# EAGLE design Heaterboard (EAGLE 9.3.1)
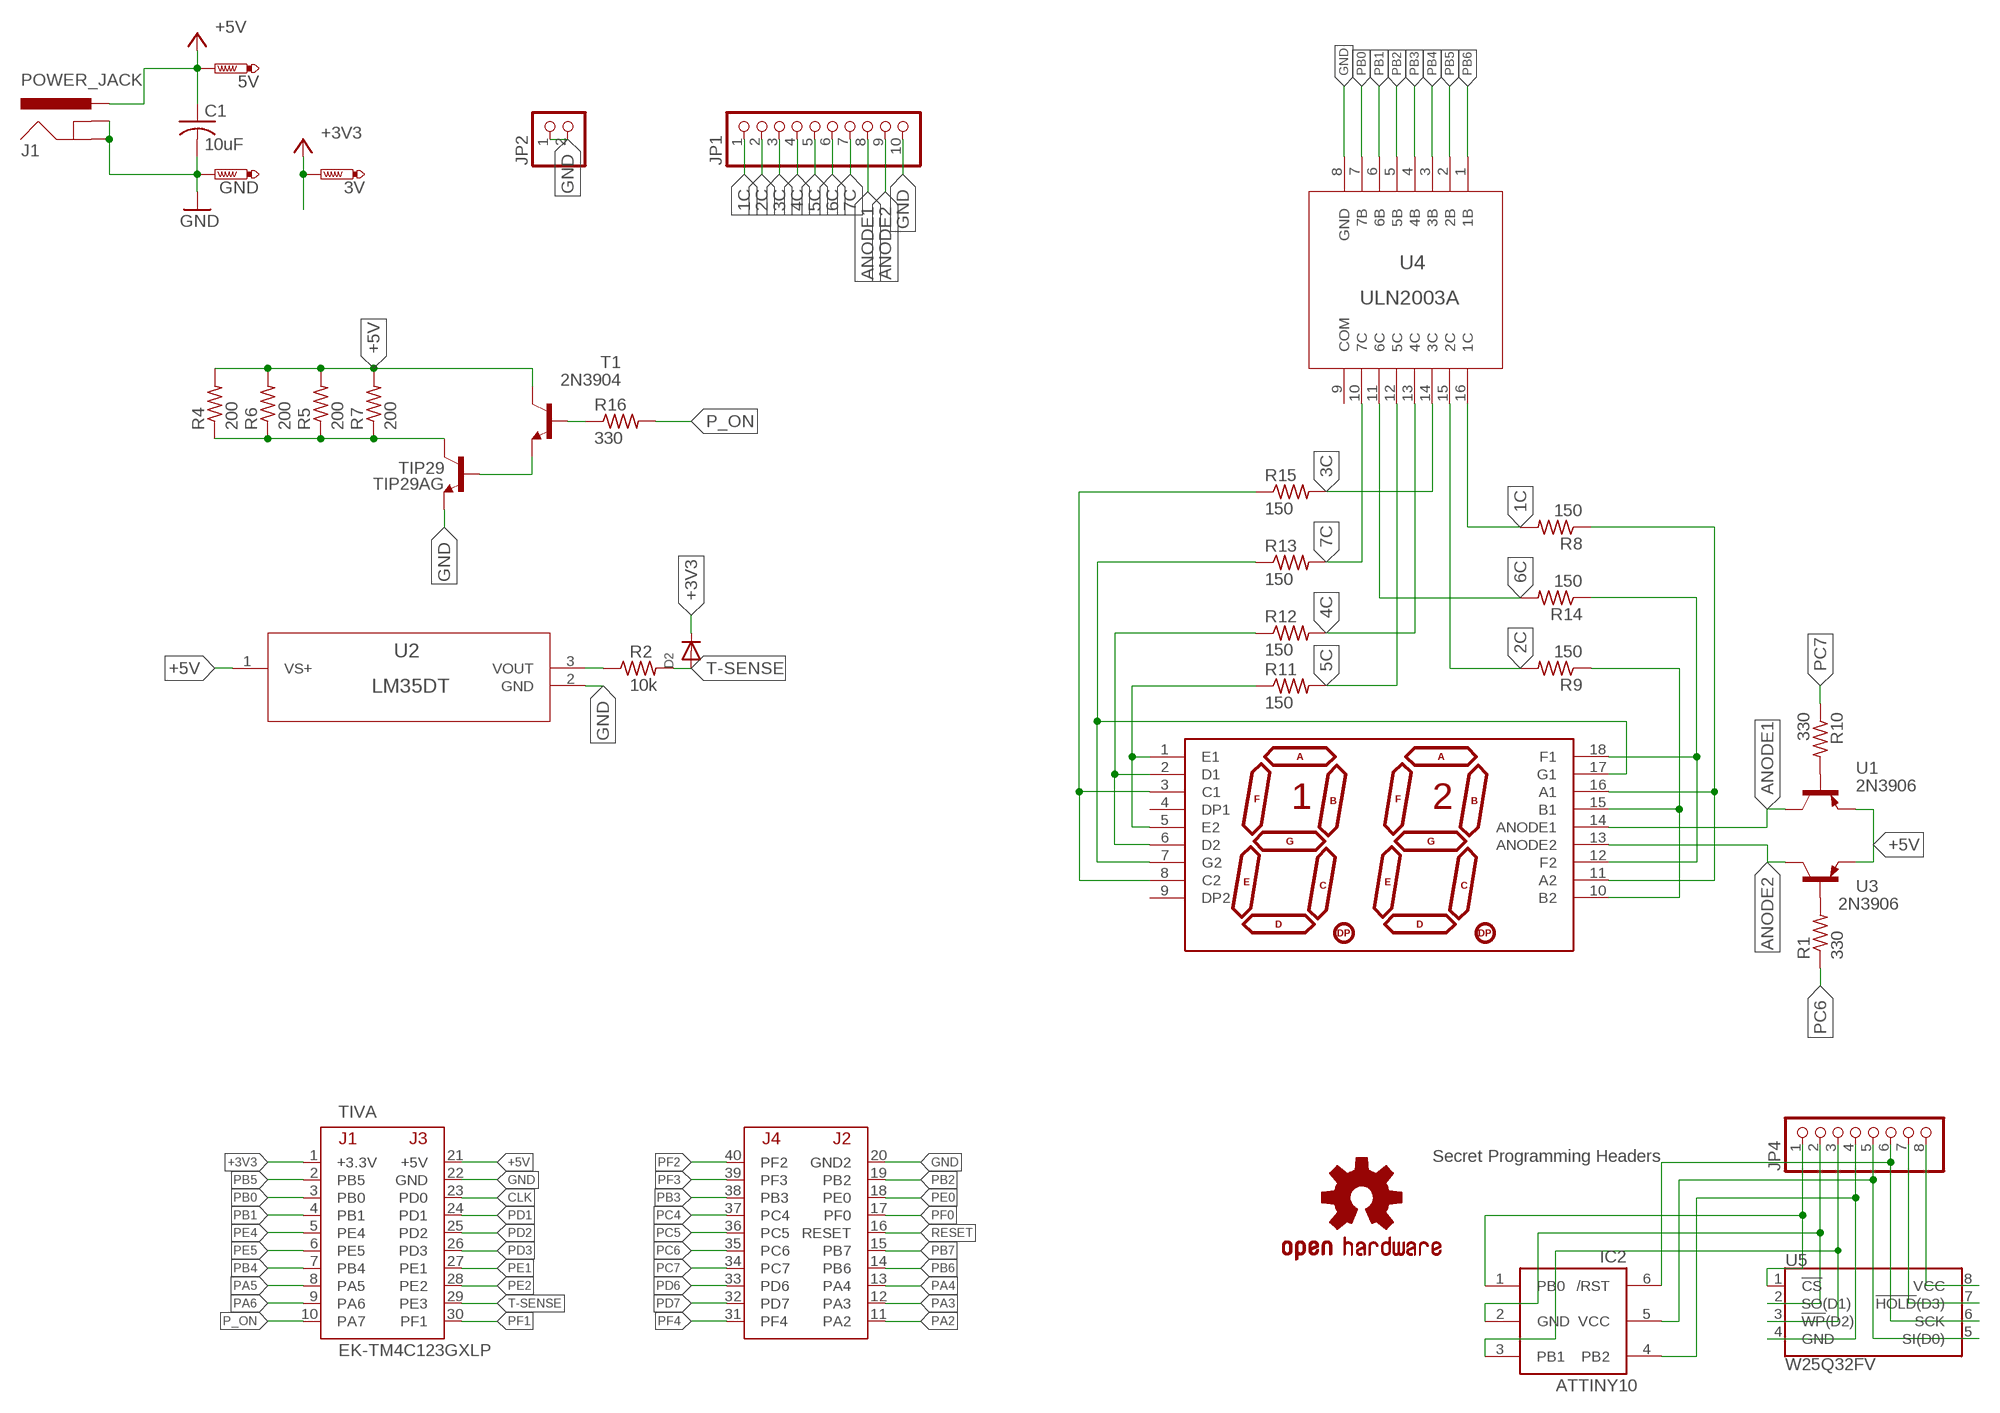
[diagram p0: schematic, sheet 1]

## Parts
3V  PTR1PAD1-13  [P1-13]
5V  PTR1PAD1-13  [P1-13]
7SEG  NTE3074  [NTE3074]
C1  10uF  C-US025-030X050  [C025-030X050]
D2  DIODEDO-1N4148  [DO-1N4148]
GND  PTR1PAD1-13  [P1-13]
IC2  ATTINY10  [SOT23-6]
J1  POWER_JACK  [POWER_JACK_PTH]
JP1  PINHD-1X10/90  [1X10/90]
JP2  PINHD-1X2  [1X02]
JP4  PINHD-1X8  [1X08]
LOGO1  OSHW-LOGOL  [OSHW-LOGO-L]
R1  330  R-US_0204/5  [0204/5]
R2  10k  R-US_0204/5  [0204/5]
R4  200  R-US_0207/10  [0207/10]
R5  200  R-US_0207/10  [0207/10]
R6  200  R-US_0207/10  [0207/10]
R7  200  R-US_0207/10  [0207/10]
R8  150  R-US_0204/5  [0204/5]
R9  150  R-US_0204/5  [0204/5]
R10  330  R-US_0204/5  [0204/5]
R11  150  R-US_0204/5  [0204/5]
R12  150  R-US_0204/5  [0204/5]
R13  150  R-US_0204/5  [0204/5]
R14  150  R-US_0204/5  [0204/5]
R15  150  R-US_0204/5  [0204/5]
R16  330  R-US_0204/5  [0204/5]
T1  2N3904  [TO92]
TIP29  TIP29AG  [TO220]
TIVA  EK-TM4C123GXLP  [TM4C123LAUNCHPAD]
U1  2N3906  [TO-92_2]
U2  LM35DT  [TA03F]
U3  2N3906  [TO-92_2]
U4  ULN2003A  [DIP-16]
U5  W25Q32FV  W25Q32FVSS  [SOIC-8]

## Nets
1C: JP1.1 R8.2 U4.16(1C)
2C: JP1.2 R9.2 U4.15(2C)
3C: JP1.3 R15.2 U4.14(3C)
4C: JP1.4 R12.2 U4.13(4C)
5C: JP1.5 R11.2 U4.12(5C)
6C: JP1.6 R14.2 U4.11(6C)
7C: JP1.7 R13.2 U4.10(7C)
+3V3 [Power]: 3V.TP D2.C TIVA.1(+3.3V)
+5V [High Current]: 5V.TP C1.1 J1.PWR R4.2 R5.2 R6.2 R7.2 T1.1(C) TIVA.21(+5V) U1.3(E) U2.1(VS+) U3.3(E)
ANODE1: 7SEG.14(ANODE1) JP1.8 U1.1(C)
ANODE2: 7SEG.13(ANODE2) JP1.9 U3.1(C)
CLK: TIVA.23(PD0)
GND [Power]: C1.2 GND.TP J1.GND J1.GNDBREAK JP1.10 JP2.1 JP2.2 TIP29.3(E) TIVA.20(GND2) TIVA.22(GND) U2.2(GND) U4.8(GND)
HEATER_COM [High Current]: R4.1 R5.1 R6.1 R7.1 TIP29.2(C)
N$1: R2.1 U2.3(VOUT)
N$3: R16.1 T1.2(B)
N$4: T1.3(E) TIP29.1(B)
N$5: R10.2 U1.2(B)
N$8: R1.2 U3.2(B)
N$9: 7SEG.11(A2) 7SEG.16(A1) R8.1
N$10: IC2.4(PB2) JP4.4 U5.4(GND)
N$12: 7SEG.10(B2) 7SEG.15(B1) R9.1
N$13: 7SEG.3(C1) 7SEG.8(C2) R15.1
N$14: 7SEG.2(D1) 7SEG.6(D2) R12.1
N$15: 7SEG.1(E1) 7SEG.5(E2) R11.1
N$16: 7SEG.12(F2) 7SEG.18(F1) R14.1
N$17: 7SEG.7(G2) 7SEG.17(G1) R13.1
N$19: IC2.1(PB0) JP4.1 U5.1(!CS!)
N$20: IC2.2(GND) JP4.2 U5.2(SO(D1))
N$21: IC2.3(PB1) JP4.3 U5.3(!WP!(D2))
N$23: IC2.5(VCC) JP4.5 U5.5(SI(D0))
N$24: IC2.6(/RST) JP4.6 U5.6(SCK)
N$25: JP4.7 U5.7(!HOLD!(D3))
N$26: JP4.8 U5.8(VCC)
P_ON: R16.2 TIVA.10(PA7)
PA2: TIVA.11(PA2)
PA3: TIVA.12(PA3)
PA4: TIVA.13(PA4)
PA5: TIVA.8(PA5)
PA6: TIVA.9(PA6)
PB0: TIVA.3(PB0) U4.7(7B)
PB1: TIVA.4(PB1) U4.6(6B)
PB2: TIVA.19(PB2) U4.5(5B)
PB3: TIVA.38(PB3) U4.4(4B)
PB4: TIVA.7(PB4) U4.3(3B)
PB5: TIVA.2(PB5) U4.2(2B)
PB6: TIVA.14(PB6) U4.1(1B)
PB7: TIVA.15(PB7)
PC4: TIVA.37(PC4)
PC5: TIVA.36(PC5)
PC6: R1.1 TIVA.35(PC6)
PC7: R10.1 TIVA.34(PC7)
PD1: TIVA.24(PD1)
PD2: TIVA.25(PD2)
PD3: TIVA.26(PD3)
PD6: TIVA.33(PD6)
PD7: TIVA.32(PD7)
PE0: TIVA.18(PE0)
PE1: TIVA.27(PE1)
PE2: TIVA.28(PE2)
PE4: TIVA.5(PE4)
PE5: TIVA.6(PE5)
PF0: TIVA.17(PF0)
PF1: TIVA.30(PF1)
PF2: TIVA.40(PF2)
PF3: TIVA.39(PF3)
PF4: TIVA.31(PF4)
RESET: TIVA.16(RESET)
T-SENSE: D2.A R2.2 TIVA.29(PE3)
Unconnected: 7SEG.4(DP1) 7SEG.9(DP2) U4.9(COM)

## Notes on the sheet
- Secret Programming Headers

## Library data of the parts
3V 5V GND = testpad:PTR1: TEST PIN
7SEG = partlibrary:NTE3074
C1 = resistor:C-US: CAPACITOR, American symbol
D2 = adafruit:DIODE: Diode SMADIODE - SMA Surface Mount Package 20V 1A Schottky Diode Digikey: 641-1014-6-ND DO-1N4148 - Through Hole Small Current Diode SOD-123 20V 1 A (.5mV Vf) Schottky Diode - Digikey: MBRX120TPMSCT-ND SOD-323 10V 570mA (.38mV Vf, 3ns) Schottky Diode - Digikey: ZLLS410CT-ND SOD-523 30V 30mA Schottky Diode (RB751S-40TE61) - Digikey: RB751S-40TE61CT-ND SOT23-R/W - SOT23 Package (R = Solder Paste/Reflow Ovens, W = Hand-Soldering) BAT54Film 40V 300mA - Digikey: 497-7162-1-ND
IC2 = adafruit:ATTINY10: ATtiny4/5/9/10 8-bit Microcontroller with 512/1024 Bytes In-System Programmable Flash
J1 = SparkFun-Connectors:POWER_JACK: Power Jack Connector This is the standard 5.5mm barrel jack for power. The PTH is the most common, proven, reliable, footprint. The Slot footprint only works if the mill layer is transmitted to the PCB fab house so be warned. Here are the connectors we sell at SparkFun: DC Barrel Power Jack/Connector <https://www.sparkfun.com/products/119> (PRT-00119) DC Barrel Power Jack/Connector (SMD) <https://www.sparkfun.com/products/12748> (PRT-12748) DC Barrel Jack Adapter - Breadboard Compatible <https://www.sparkfun.com/products/10811> (PRT-10811) It is used on this SparkFun product (and many, many others): SparkFun RedBoard - Programmed with Arduino <https://www.sparkfun.com/products/12757> (DEV-12757) Also, if you need a mating power supply or connector, please check these out: Wall Adapter Power Supply - 9VDC 650mA <https://www.sparkfun.com/products/298> (TOL-00298) DC Barrel Jack Adapter - Male <https://www.sparkfun.com/products/10287> (PRT-10287); PROD_ID: CONN-08197
JP1 = pinhead:PINHD-1X10: PIN HEADER
JP2 = pinhead:PINHD-1X2: PIN HEADER
JP4 = pinhead:PINHD-1X8: PIN HEADER
LOGO1 = SparkFun-Aesthetics:OSHW-LOGO: Open-Source Hardware (OSHW) Logo This logo indicates the piece of hardware it is found on incorporates a OSHW license and/or adheres to the definition of open source hardware found here: http://freedomdefined.org/OSHW
R1 R2 R4-R16 = resistor:R-US_: RESISTOR, American symbol
T1 = transistor:2N3904: NPN TRANSISTOR
TIP29 = partlibrary:TIP29AG
TIVA = EK-TM4C123GXL:EK-TM4C123GXL: Texas Instruments TM4C123 LaunchPad EK-TM4C123GXL www.ti.com/tool/ek-tm4c123gxl; AVAILABILITY: Unavailable; DESCRIPTION: Evaluation Kit For ARM Cortex-M4F-based Microcontrollers; MF: Texas Instruments; MP: EK-TM4C123GXL; PACKAGE: None; PRICE: None
U1 U3 = partlibrary:2N3906; MANUFACTURER_PART_NUMBER: 2N3906; VENDOR: Fairchild Semiconductor
U2 = partlibrary:LM35DT; MANUFACTURER_PART_NUMBER: LM35DT; VENDOR: Texas Instruments
U4 = partlibrary:ULN2003A; MANUFACTURER_PART_NUMBER: ULN2003A; VENDOR: STMicroelectronics
U5 = SparkFun-IC-Memory:W25Q32FV: W25Q32FV 32Mb (4MB) Serial Flash Memory The W25Q32FV support the standard Serial Peripheral Interface (SPI), Dual/Quad I/O SPI as well as 2-clocks instruction cycle Quad Peripheral Interface (QPI). 104MHz, SPI, 8-SOIC-EIAJ Datasheet <http://www.winbond.com/resource-files/w25q32fv%20revh%20091613.pdf> SparkFun Products SparkFun Blynk Board - ESP8266 <https://www.sparkfun.com/products/13794> (WRL-13794); PROD_ID: IC-13229

## Net classes
0 default: width 0.254 mm, clearance 0.254 mm
1 High Current: width 1.27 mm, clearance 0.508 mm
2 Power: width 0.762 mm, clearance 0.254 mm

## Board
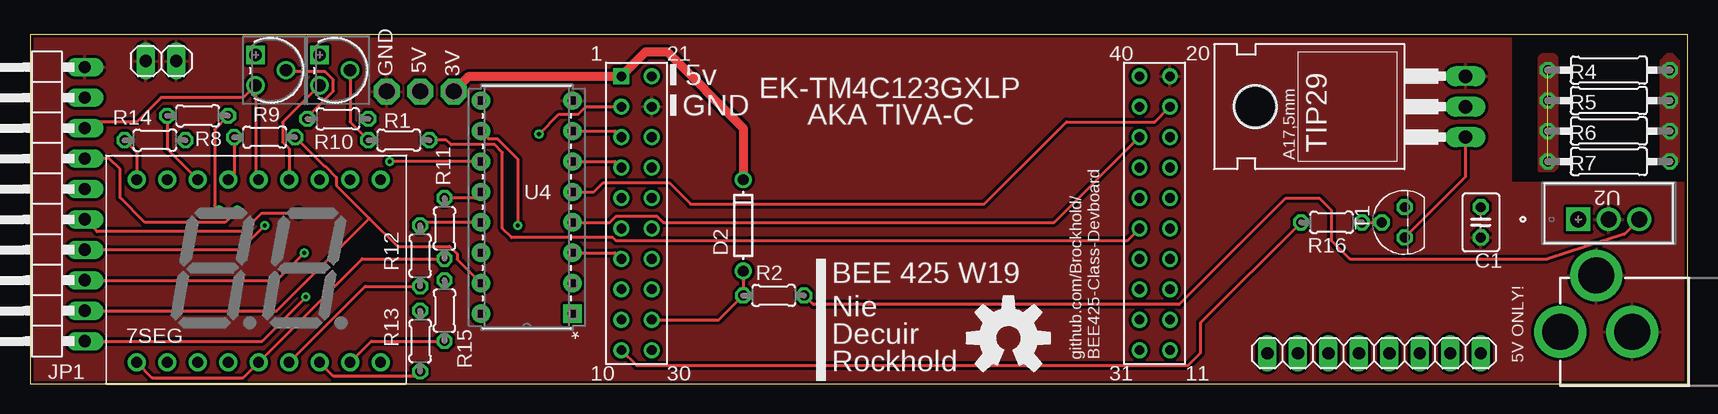
[diagram p1: board, top side]
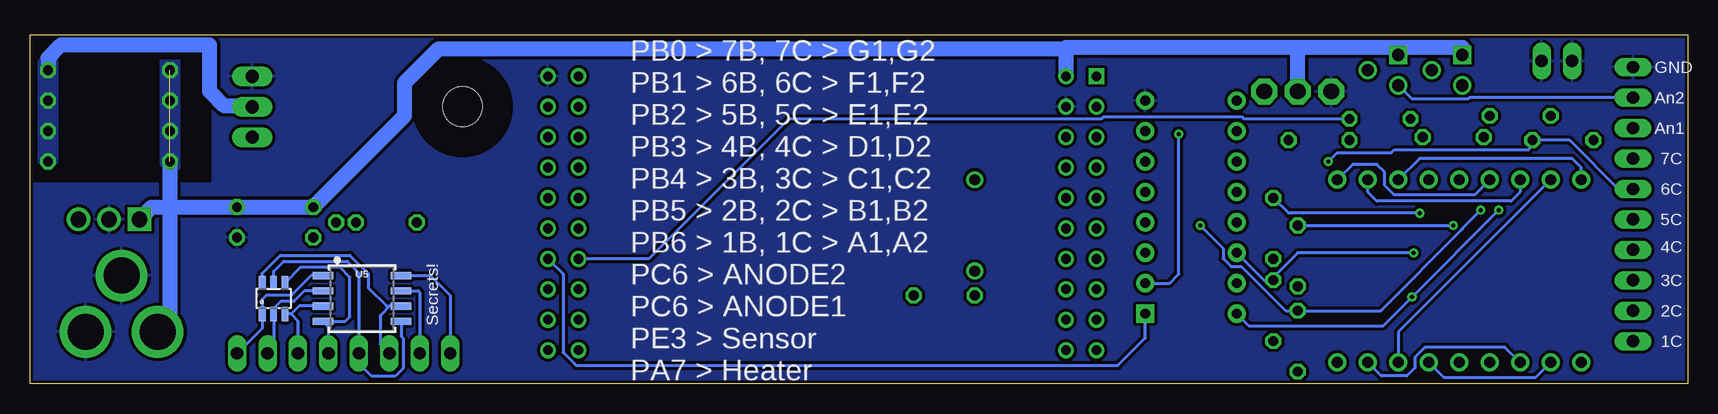
[diagram p2: board, bottom side, seen from below]

Size 138.16 x 29.13 mm. Coordinates in mm from the lower left corner, seen from the top.
Outline: 0,0 138.16,0 138.16,29.13 0,29.13 0,0
Copper layers (1*16): Top 0.035mm / dielectric 1.5mm / Bottom 0.035mm
Design rules "default *": minimum track width 6mil, minimum drill 0.35mm, track to track 6mil, track to pad 6mil, pad to pad 6mil, via to via 6mil, smd to smd 6mil, copper to edge 10mil, drill to drill 6mil, minimum pad ring 10mil, minimum via ring 8mil, stop-mask expansion 4mil, vias tented up to drill 0mil, thermal gap 10mil

### Footprints (pad centres in the part's own frame; a part is rotated, then mirrored left to right if it is on the bottom)
P1-13 = drill 1.321 pad 2.159 octagon: TP 0,0
NTE3074 = drill 0.9 pad 1.524: 1 2.54,1.778 | drill 0.9 pad 1.5: 2 5.08,1.778; 3 7.62,1.778; 4 10.16,1.778; 5 12.7,1.778; 6 15.24,1.778; 7 17.78,1.778; 8 20.32,1.778; 9 22.86,1.778; 10 22.86,17.018; 11 20.32,17.018; 12 17.78,17.018; 13 15.24,17.018; 14 12.7,17.018; 15 10.16,17.018; 16 7.62,17.018; 17 5.08,17.018; 18 2.54,17.018
C025-030X050 = drill 0.813 octagon: 1 -1.27,0; 2 1.27,0
DO-1N4148 = drill 0.9: A -3.81,0; C 3.81,0
SOT23-6 = smd 0.55 x 1.2: 1 -0.95,-1.3; 2 0,-1.3; 3 0.95,-1.3; 4 0.95,1.3; 5 0,1.3; 6 -0.95,1.3
POWER_JACK_PTH = drill 2.997 pad 4.318: GND 0,7.7; GNDBREAK 4.7,10.7; PWR 0,13.7
1X10/90 = drill 1.016 long: 1 -11.43,-3.81; 2 -8.89,-3.81; 3 -6.35,-3.81; 4 -3.81,-3.81; 5 -1.27,-3.81; 6 1.27,-3.81; 7 3.81,-3.81; 8 6.35,-3.81; 9 8.89,-3.81; 10 11.43,-3.81
1X02 = drill 1.016 long: 1 -1.27,0; 2 1.27,0
1X08 = drill 1.016 long: 1 -8.89,0; 2 -6.35,0; 3 -3.81,0; 4 -1.27,0; 5 1.27,0; 6 3.81,0; 7 6.35,0; 8 8.89,0
0204/5 = drill 0.813 octagon: 1 -2.54,0; 2 2.54,0
0207/10 = drill 0.813 octagon: 1 -5.08,0; 2 5.08,0
TO92 = drill 0.813 octagon: 1 1.27,0; 2 0,1.905; 3 -1.27,0
TO220 = drill 1.118 long: 1 -2.54,-6.35; 2 0,-6.35; 3 2.54,-6.35 | hole 3.302: 0,11.176
TM4C123LAUNCHPAD = drill 0.8 square: 1 -22.86,12.7 | drill 0.8: 2 -22.86,10.16; 3 -22.86,7.62; 4 -22.86,5.08; 5 -22.86,2.54; 6 -22.86,0; 7 -22.86,-2.54; 8 -22.86,-5.08; 9 -22.86,-7.62; 10 -22.86,-10.16; 11 22.86,-10.16; 12 22.86,-7.62; 13 22.86,-5.08; 14 22.86,-2.54; 15 22.86,0; 16 22.86,2.54; 17 22.86,5.08; 18 22.86,7.62; 19 22.86,10.16; 20 22.86,12.7; 21 -20.32,12.7; 22 -20.32,10.16; 23 -20.32,7.62; 24 -20.32,5.08; 25 -20.32,2.54; 26 -20.32,0; 27 -20.32,-2.54; 28 -20.32,-5.08; 29 -20.32,-7.62; 30 -20.32,-10.16; 31 20.32,-10.16; 32 20.32,-7.62; 33 20.32,-5.08; 34 20.32,-2.54; 35 20.32,0; 36 20.32,2.54; 37 20.32,5.08; 38 20.32,7.62; 39 20.32,10.16; 40 20.32,12.7
TO-92_2 = drill 1.016 pad 1.524: 1 0,-2.54; 2 -1.27,0 | drill 1.016 pad 1.524 square: 3 -2.54,-2.54
TA03F = drill 1.321 pad 1.829 square: 1 -5.08,-1.016 | drill 1.321 pad 1.829: 2 -2.54,-1.016; 3 0,-1.016
DIP-16 = drill 0.813 pad 1.524 square: 1 -7.62,17.78 | drill 0.813 pad 1.524: 2 -7.62,15.24; 3 -7.62,12.7; 4 -7.62,10.16; 5 -7.62,7.62; 6 -7.62,5.08; 7 -7.62,2.54; 8 -7.62,0; 9 0,0; 10 0,2.54; 11 0,5.08; 12 0,7.62; 13 0,10.16; 14 0,12.7; 15 0,15.24; 16 0,17.78
SOIC-8 = smd 0.61 x 1.702: 1 -1.905,-3.251; 2 -0.635,-3.251; 3 0.635,-3.251; 4 1.905,-3.251; 5 1.905,3.251; 6 0.635,3.251; 7 -0.635,3.251; 8 -1.905,3.251

### Placement (x,y rotation side)
3V  35.31,24.38 180 top
5V  32.51,24.38 180 top
7SEG  6.35,0 0 top
C1  120.9,13.46 270 top
D2  59.44,13.21 90 top
GND  29.72,24.38 0 top
IC2  117.86,7.11 0 bottom
J1  141.22,4.32 90 top
JP1  0.76,14.99 90 top
JP2  10.92,26.92 0 top
JP4  112.01,2.54 180 top
LOGO1  81.53,3.81 0 top
R1  30.73,20.32 180 top
R2  61.98,7.37 180 top
R4  131.57,26.16 180 top
R5  131.57,23.62 180 top
R6  131.57,21.08 180 top
R7  131.57,18.54 180 top
R8  13.97,22.35 0 top
R9  19.56,20.57 0 top
R10  25.65,22.1 180 top
R11  34.54,12.95 90 top
R12  32.51,10.67 90 top
R13  32.51,3.56 90 top
R14  10.41,20.32 0 top
R15  34.54,6.1 90 top
R16  108.46,13.46 180 top
T1  114.55,13.46 90 top
TIP29  113.28,23.11 90 top
TIVA  72.14,12.95 0 top
U1  21.34,24.89 270 top
U2  134.11,14.73 0 top
U3  26.67,24.89 270 top
U4  37.59,23.62 180 top
U5  110.49,7.11 270 bottom

### Tracks (layer width: path | path; a pad name or v marks a point on that pad's centre or on a via)
1C  (via drill 0.35)
  Top 0.254: v15.75,14.48 15.38,14.85 15.38,21.22 R8.2 | JP1.1 19.35,3.56 22.99,7.19 v22.99,7.24
  Bottom 0.254: U4.16 36.58,4.83 25.4,4.83 v22.99,7.24 v15.75,14.48
2C
  Top 0.254: R9.2 24.52,18.15 24.6,18.15 25.54,17.21 25.54,16.55 28.28,13.8 | U4.15 35.59,10.39 35.59,10.84 34.98,11.45 30.63,11.45 28.28,13.8 | JP1.2 20.57,6.1 28.28,13.8
3C  (via drill 0.35)
  Top 0.254: JP1.3 20.57,8.64 v22.86,10.92
  Bottom 0.254: U4.14 35.31,8.64 34.8,8.64 | 34.8,8.64 R15.2 | v22.86,10.92 32.51,10.92 34.8,8.64
4C  (via drill 0.35)
  Top 0.254: U4.13 32.77,13.46 R12.2 | v19.56,13.21 17.53,11.18 JP1.4
  Bottom 0.254: R12.2 v19.56,13.21
5C  (via drill 0.35)
  Top 0.254: U4.12 37.08,15.49 R11.2 | JP1.5 5.59,12.7 17.78,12.7 19.3,14.22 v22.35,14.22
  Bottom 0.254: R11.2 33.27,14.22 32.97,14.22 32.94,14.25 32.08,14.25 32.05,14.22 v22.35,14.22
6C  (via drill 0.35)
  Top 0.254: U4.11 v29.97,18.54
  Bottom 0.254: v29.97,18.54 29.23,19.28 24.72,19.28 24.46,19.53 13.29,19.53 12.95,19.86 R14.2 9.86,20.32 5.79,16.26 JP1.6
7C  (via drill 0.35)
  Top 0.254: U4.10 38.23,20.45 38.95,20.45 40.64,18.75 v40.64,13.21 | v17.27,14.48 16.26,13.46 9.58,13.46 7.51,15.53 7.51,17.89 6.6,18.8 JP1.7
  Bottom 0.254: v40.64,13.21 38.73,11.3 38.73,10.45 38.07,9.78 37.21,9.78 33.53,6.1 R13.2 25.6,6.1 18.8,12.89 18.8,12.95 v17.27,14.48
+3V3
  Top 0.762: D2.C 59.44,21.34 53.09,27.69 51.31,27.69 TIVA.1 36.58,25.65 3V.TP
+5V  (3 unrouted)
  Bottom 1.27: 51.82,27.94 104.11,27.94 106.93,25.11 106.93,22.35 T1.1 C1.1 126.49,14.73 | 32.51,28.07 51.82,28.07 51.82,27.94 | 32.51,28.07 24.13,28.07 | U3.3 24.13,28.07 | 24.13,28.07 18.8,28.07 U1.3 | TIVA.21 51.82,27.94 | 5V.TP 32.51,28.07 | J1.PWR 126.49,5.35 126.49,14.73 | U2.1 128.02,14.73 126.49,14.73 | R7.2 126.49,14.73
  pour Top (no thermals): 125.73,17.78 127,17.78 127.25,18.03 127.25,27.18 127,27.43 125.98,27.43 125.73,27.18
  pour Bottom (no thermals): 127.25,18.29 126.75,17.78 125.98,17.78 125.73,18.03 125.73,27.18 127.25,27.18
ANODE1
  Top 0.254: 7SEG.14 18.8,17.27 U1.1 17.78,23.88 10.92,23.88 8.89,21.84 5.08,21.84 JP1.8
ANODE2
  Top 0.254: 7SEG.13 21.59,19.61 21.06,20.14 21.06,21.82 U3.1
  Bottom 0.254: JP1.9 18.2,23.88 18.32,23.75 22.99,23.75 U3.1
GND
  pour Top (rank 6): -0.25,30.23 -0.25,-1.02 138.18,-1.02 138.18,16.76 123.44,16.76 123.44,30.23
  pour Bottom (rank 6): -0.25,29.46 -0.25,-1.52 138.18,-1.52 138.18,16.76 122.94,16.76 122.94,29.46
HEATER_COM
  Bottom 1.27: TIP29.2 119.68,23.16 121.95,23.16 123.19,24.4 123.19,28.24 135.59,28.24 136.65,27.18 R4.1
  pour Top (no thermals): 135.89,26.92 135.89,18.54 136.14,18.29 137.16,18.29 137.41,18.54 137.41,26.92 136.91,27.43 136.4,27.43
  pour Bottom (no thermals): 137.41,26.92 137.41,18.54 137.16,18.29 136.14,18.29 135.89,18.54 135.89,26.92 136.4,27.43 136.91,27.43
N$1
  Top 0.254: R2.1 65.28,6.6 95.76,6.6 104.65,15.49 107.44,15.49 108.46,14.48 108.46,11.94 109.98,10.41 126.49,10.41 132.89,12.49 U2.3
N$3
  Top 0.254: R16.1 T1.2
N$4
  Top 0.254: T1.3 119.63,17.27 TIP29.1
N$5
  Top 0.254: U1.2 21.46,26.04 24.6,26.04 25.27,25.36 25.27,24.42 23.11,22.26 R10.2
N$8
  Top 0.254: U3.2 26.67,21.84 R1.2
N$9
  Top 0.254: R8.1 11.43,19.56 7SEG.16
  Bottom 0.254: 7SEG.16 13.97,16 14.73,15.24 25.91,15.24 26.67,16 7SEG.11
N$10
  Bottom 0.254: JP4.4 113.28,4.75 U5.4 111.89,5.21 111.51,5.59 111.51,8.89 112.32,9.7 115.61,9.7 IC2.4
N$12
  Top 0.254: R9.1 17.02,17.53 7SEG.15
  Bottom 0.254: 7SEG.15 17.78,15.75 24.46,15.75 25.26,16.55 25.26,17.64 25.91,18.29 27.94,18.29 7SEG.10
N$13
  Top 0.254: 7SEG.8 28.45,3.56 R15.1
  Bottom 0.254: 7SEG.3 15.24,3.05 21.92,3.05 22.74,2.22 22.74,1.31 23.41,0.65 25.54,0.65 7SEG.8
N$14
  Top 0.254: 7SEG.6 27.94,8.13 R12.1
  Bottom 0.254: 7SEG.2 12.7,0.51 20.32,0.51 7SEG.6
N$15
  Top 0.254: 7SEG.1 10.16,0.51 17.78,0.51 7SEG.5 27.69,10.41 R11.1
N$16
  Top 0.254: R14.1 8.89,19.3 7SEG.18
  Bottom 0.254: 7SEG.18 8.89,18.03 9.65,18.8 22.35,18.8 7SEG.12
N$17
  Top 0.254: R13.1 32.13,0.63 25.27,0.63 7SEG.7
  Bottom 0.254: 7SEG.17 24.13,4.32 7SEG.7
N$19
  Bottom 0.254: JP4.1 118.81,4.64 IC2.1 118.81,7.04 118.48,7.37 116.38,7.37 114.73,9.02 U5.1
N$20
  Bottom 0.254: JP4.2 117.86,3.05 IC2.2 117.86,6.28 117.27,6.86 116.17,6.86 115.28,7.75 U5.2
N$21
  Bottom 0.254: 116.4,5.81 115.82,5.24 JP4.3 | U5.3 115.73,6.48 116.4,5.81 | 116.4,5.81 IC2.3
N$23
  Bottom 0.254: IC2.5 117.86,9.38 117.03,10.21 111.72,10.21 110.74,9.24 JP4.5 110.74,1.69 109.69,0.63 107.73,0.63 107.06,1.31 107.06,3.78 107.24,3.95 U5.5
N$24
  Bottom 0.254: JP4.6 108.98,3.32 108.98,5.67 108.17,6.48 U5.6 108.45,6.48 109.98,8.01 109.98,9.2 111.51,10.72 117.3,10.72 118.81,9.21 IC2.6
N$25
  Bottom 0.254: U5.7 105.8,7.75 105.66,7.61 JP4.7
N$26
  Bottom 0.254: U5.8 104.78,9.02 103.12,7.36 JP4.8
P_ON
  Top 0.254: TIVA.10 50.55,1.52 96.52,1.52 97.54,2.54 97.54,5.08 R16.2
PB0
  Top 0.254: U4.7 48.77,21.08 TIVA.3
PB1
  Top 0.254: U4.6 48.77,18.54 TIVA.4
PB2
  Top 0.254: U4.5 46.99,16 47.77,16.78 53.26,16.78 55.06,14.99 79.5,14.99 86.36,21.84 93.73,21.84 TIVA.19
PB3
  Top 0.254: U4.4 48.32,13.46 48.85,13.99 52.25,13.99 52.77,13.46 85.34,13.46 TIVA.38
PB4
  Top 0.254: U4.3 48.77,10.92 TIVA.7
PB5  (via drill 0.35)
  Top 0.254: TIVA.2 46.32,23.11 45.69,22.48 44.07,22.48 v42.42,20.83
  Bottom 0.254: U4.2 43.18,8.38 42.42,9.14 v42.42,20.83
PB6
  Bottom 0.254: TIVA.14 93.73,9.14 93.73,2.6 92.65,1.52 47.5,1.52 45.21,3.81 U4.1
PC6
  Top 0.254: TIVA.35 91.42,11.92 48.85,11.92 48.57,12.19 40.13,12.19 39.37,12.95 39.37,19.3 38.73,19.94 35.09,19.94 34.71,20.32 R1.1
PC7
  Bottom 0.254: R10.1 36.99,22.1 37.12,22.22 48.7,22.22 48.85,22.08 52.25,22.08 52.26,22.1 74.93,22.1 86.61,10.41 TIVA.34
T-SENSE
  Top 0.254: D2.A R2.2 57.4,5.33 TIVA.29

### Text on the board
tNames: 5v | GND | AKA TIVA-C | BEE 425 W19 | Nie | Decuir | github.com/Brockhold/ / BEE425-Class-Devboard | Rockhold | 5V ONLY!
bNames: GND | An2 | An1 | 7C | 6C | 5C | 4C | 3C | 2C | Secrets! | 1C | PB0 > 7B, 7C > G1,G2 / PB1 > 6B, 6C > F1,F2 / PB2 > 5B, 5C > E1,E2 / PB3 > 4B, 4C > D1,D2 / PB4 > 3B, 3C > C1,C2 / PB5 > 2B, 2C > B1,B2 / PB6 > 1B, 1C > A1,A2 / PC6 > ANODE2 / PC6 > ANODE1 / PE3 > Sensor / PA7 > Heater